# Altium schematic sheet EEPROM.SchDoc
size A4
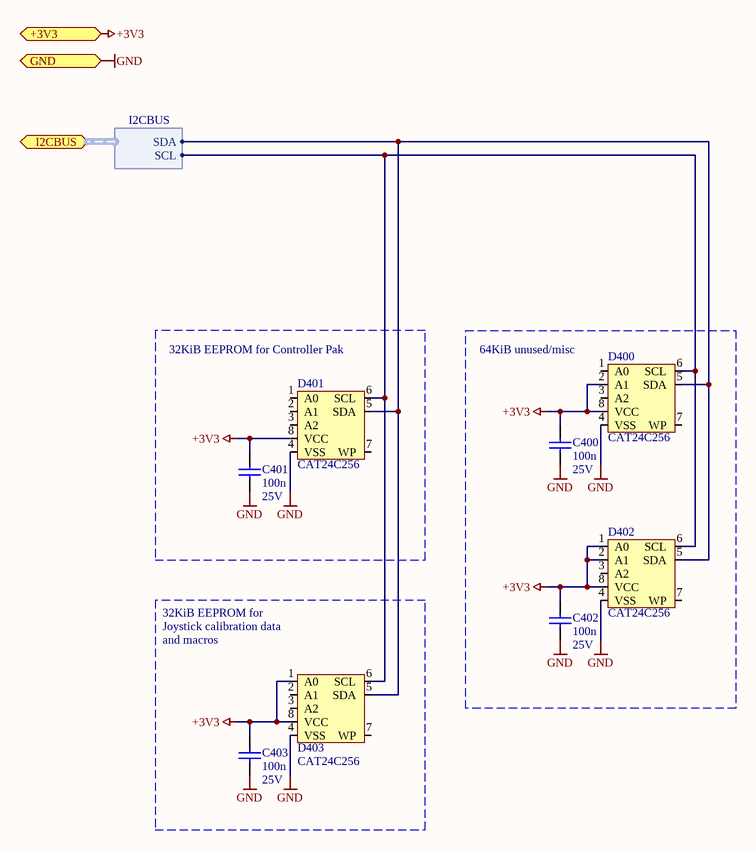
[diagram p0: EEPROM.SchDoc]

## Parts
C400  value 100n  Value2: 25V  [SMD_CAP_0402]  (hidden comment: C_SMD_CER_100N_25V_10%_X7R_0402)
C401  value 100n  Value2: 25V  [SMD_CAP_0402]  (hidden comment: C_SMD_CER_100N_25V_10%_X7R_0402)
C402  value 100n  Value2: 25V  [SMD_CAP_0402]  (hidden comment: C_SMD_CER_100N_25V_10%_X7R_0402)
C403  value 100n  Value2: 25V  [SMD_CAP_0402]  (hidden comment: C_SMD_CER_100N_25V_10%_X7R_0402)
D400  Type: CAT24C256  [SMD_TSSOP_8]  (hidden comment: D_CAT24C256_EEPROM_TSSOP-8)
D401  Type: CAT24C256  [SMD_TSSOP_8]  (hidden comment: D_CAT24C256_EEPROM_TSSOP-8)
D402  Type: CAT24C256  [SMD_TSSOP_8]  (hidden comment: D_CAT24C256_EEPROM_TSSOP-8)
D403  Type: CAT24C256  [SMD_TSSOP_8]  (hidden comment: D_CAT24C256_EEPROM_TSSOP-8)

## Blocks framed on the sheet
32KiB EEPROM for Controller Pak: C401 D401
64KiB unused/misc: C400 C402 D400 D402

## Ports
+3V3, GND, I2CBUS (harness I2CBUS)

## Harnesses
I2CBUS: SCL, SDA

## Nets
+3V3: C400.2 C401.2 C402.2 C403.2 D400.2(A1) D400.8(VCC) D401.8(VCC) D402.1(A0) D402.2(A1) D402.8(VCC) D403.1(A0) D403.8(VCC) ; port +3V3
GND: C400.1 C401.1 C402.1 C403.1 D400.4(VSS) D401.4(VSS) D402.4(VSS) D403.4(VSS) ; port GND
NetD400_5: D400.5(SDA) D401.5(SDA) D402.5(SDA) D403.5(SDA) ; port I2CBUS.SDA
NetD400_6: D400.6(SCL) D401.6(SCL) D402.6(SCL) D403.6(SCL) ; port I2CBUS.SCL

Not connected (* = marked no-connect by the designer): D400 1(A0) 3(A2) 7(WP); D401 1(A0) 2(A1) 3(A2) 7(WP); D402 3(A2) 7(WP); D403 2(A1) 3(A2) 7(WP)

## Notes on the sheet
- 32KiB EEPROM for
- (near D403) Joystick calibration data
- and macros
- Title
- Size:
- Date:
- A4
- Number:
- Time:
- Revision:
- Sheet
- of
- File:

## Library data of the parts
C400-C403 = C_SMD_CER_100N_25V_10%_X7R_0402: 0.1µF ±10% 25V Ceramic Capacitor X7R 0402 (1005 Metric); Supplier - Digikey: 490-14603-1-ND
D400-D403 = D_CAT24C256_EEPROM_TSSOP-8: IC EEPROM 256K I2C 1MHZ 8TSSOP; Supplier - Digikey: CAT24C256YI-GT3OSCT-ND